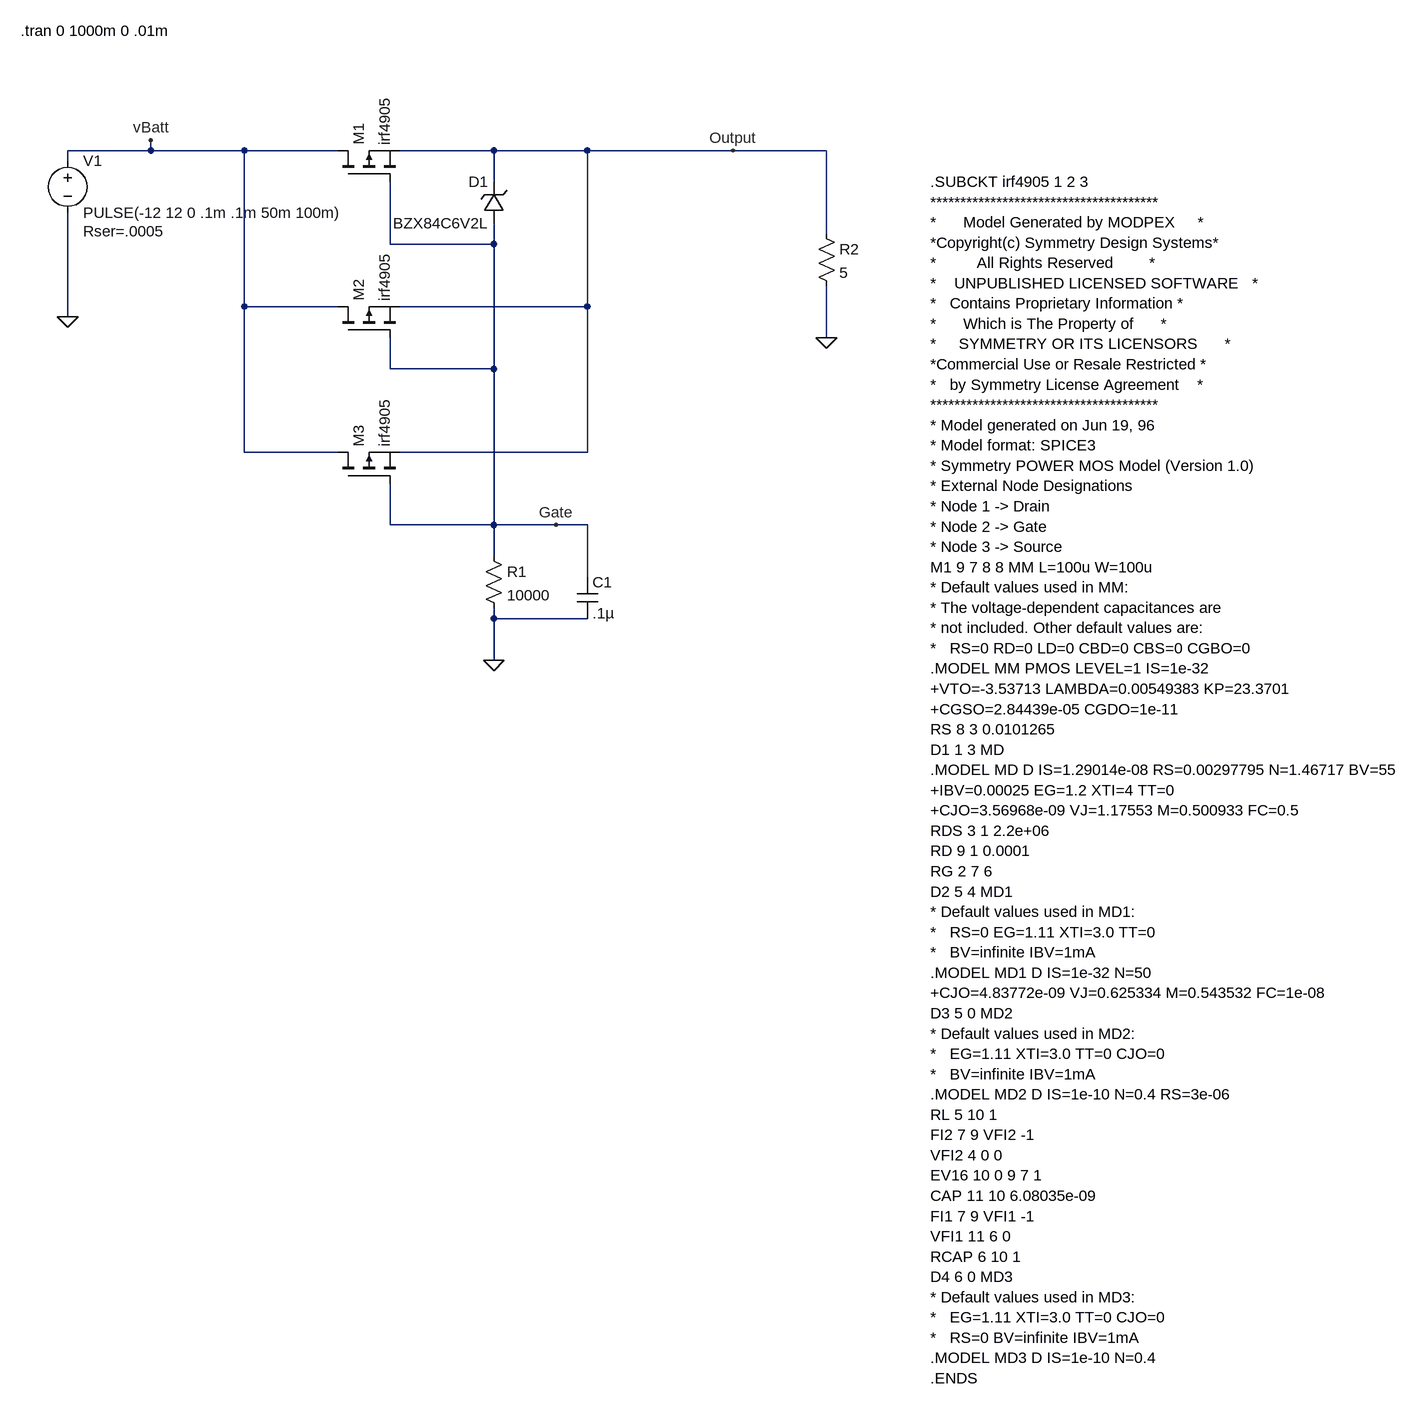
[diagram p0: schematic ReversePolarityProtection_2.asc]
ReversePolarityProtection_2.asc, the LTspice schematic file:
Version 4
SHEET 1 1748 1684
WIRE -176 -32 -176 -48
WIRE -176 -32 -304 -32
WIRE -32 -32 -176 -32
WIRE 112 -32 -32 -32
WIRE 352 -32 208 -32
WIRE 496 -32 352 -32
WIRE 720 -32 496 -32
WIRE 864 -32 720 -32
WIRE -304 -16 -304 -32
WIRE 352 16 352 -32
WIRE 864 96 864 -32
WIRE 192 112 192 16
WIRE 352 112 352 80
WIRE 352 112 192 112
WIRE -32 208 -32 -32
WIRE 112 208 -32 208
WIRE 496 208 496 -32
WIRE 496 208 208 208
WIRE -304 224 -304 64
WIRE 864 256 864 176
WIRE 192 304 192 256
WIRE 352 304 352 112
WIRE 352 304 192 304
WIRE -32 432 -32 208
WIRE 112 432 -32 432
WIRE 496 432 496 208
WIRE 496 432 208 432
WIRE 192 544 192 480
WIRE 352 544 352 304
WIRE 352 544 192 544
WIRE 448 544 352 544
WIRE 496 544 448 544
WIRE 352 592 352 544
WIRE 496 624 496 544
WIRE 352 688 352 672
WIRE 496 688 352 688
WIRE 352 752 352 688
FLAG 352 752 0
FLAG -304 224 0
FLAG 864 256 0
FLAG -176 -48 vBatt
FLAG 720 -32 Output
FLAG 448 544 Gate
SYMBOL pmos 112 16 R270
SYMATTR InstName M1
SYMATTR Value irf4905
SYMATTR Prefix X
SYMBOL pmos 112 256 R270
SYMATTR InstName M2
SYMATTR Value irf4905
SYMATTR Prefix X
SYMBOL pmos 112 480 R270
SYMATTR InstName M3
SYMATTR Value irf4905
SYMATTR Prefix X
SYMBOL voltage -304 -32 R0
WINDOW 123 0 0 Left 2
WINDOW 39 24 124 Left 2
SYMATTR SpiceLine Rser=.0005
SYMATTR InstName V1
SYMATTR Value PULSE(-12 12 0 .1m .1m 50m 100m)
SYMBOL zener 368 80 R180
WINDOW 0 24 64 Left 2
WINDOW 3 24 0 Left 2
SYMATTR InstName D1
SYMATTR Value BZX84C6V2L
SYMBOL res 336 576 R0
SYMATTR InstName R1
SYMATTR Value 10000
SYMATTR SpiceLine tol=5 pwr=.1
SYMBOL res 848 80 R0
SYMATTR InstName R2
SYMATTR Value 5
SYMATTR SpiceLine tol=5 pwr=200
SYMBOL cap 480 624 R0
SYMATTR InstName C1
SYMATTR Value .1µ
SYMATTR SpiceLine V=50
TEXT -376 -216 Left 2 !.tran 0 1000m 0 .01m
TEXT 1024 16 Left 2 !.SUBCKT irf4905 1 2 3\n**************************************\n*      Model Generated by MODPEX     *\n*Copyright(c) Symmetry Design Systems*\n*         All Rights Reserved        *\n*    UNPUBLISHED LICENSED SOFTWARE   *\n*   Contains Proprietary Information *\n*      Which is The Property of      *\n*     SYMMETRY OR ITS LICENSORS      *\n*Commercial Use or Resale Restricted *\n*   by Symmetry License Agreement    *\n**************************************\n* Model generated on Jun 19, 96\n* Model format: SPICE3\n* Symmetry POWER MOS Model (Version 1.0)\n* External Node Designations\n* Node 1 -> Drain\n* Node 2 -> Gate\n* Node 3 -> Source\nM1 9 7 8 8 MM L=100u W=100u\n* Default values used in MM:\n* The voltage-dependent capacitances are\n* not included. Other default values are:\n*   RS=0 RD=0 LD=0 CBD=0 CBS=0 CGBO=0\n.MODEL MM PMOS LEVEL=1 IS=1e-32\n+VTO=-3.53713 LAMBDA=0.00549383 KP=23.3701\n+CGSO=2.84439e-05 CGDO=1e-11\nRS 8 3 0.0101265\nD1 1 3 MD\n.MODEL MD D IS=1.29014e-08 RS=0.00297795 N=1.46717 BV=55\n+IBV=0.00025 EG=1.2 XTI=4 TT=0\n+CJO=3.56968e-09 VJ=1.17553 M=0.500933 FC=0.5\nRDS 3 1 2.2e+06\nRD 9 1 0.0001\nRG 2 7 6\nD2 5 4 MD1\n* Default values used in MD1:\n*   RS=0 EG=1.11 XTI=3.0 TT=0\n*   BV=infinite IBV=1mA\n.MODEL MD1 D IS=1e-32 N=50\n+CJO=4.83772e-09 VJ=0.625334 M=0.543532 FC=1e-08\nD3 5 0 MD2\n* Default values used in MD2:\n*   EG=1.11 XTI=3.0 TT=0 CJO=0\n*   BV=infinite IBV=1mA\n.MODEL MD2 D IS=1e-10 N=0.4 RS=3e-06\nRL 5 10 1\nFI2 7 9 VFI2 -1\nVFI2 4 0 0\nEV16 10 0 9 7 1\nCAP 11 10 6.08035e-09\nFI1 7 9 VFI1 -1\nVFI1 11 6 0\nRCAP 6 10 1\nD4 6 0 MD3\n* Default values used in MD3:\n*   EG=1.11 XTI=3.0 TT=0 CJO=0\n*   RS=0 BV=infinite IBV=1mA\n.MODEL MD3 D IS=1e-10 N=0.4\n.ENDS

The netlist it stands for:
* ReversePolarityProtection_2.asc
XM1 vBatt Gate Output irf4905  ; pins D G S
XM2 vBatt Gate Output irf4905  ; pins D G S
XM3 vBatt Gate Output irf4905  ; pins D G S
V1 vBatt 0 PULSE(-12 12 0 .1m .1m 50m 100m) Rser=.0005
D1 Gate Output BZX84C6V2L
R1 Gate 0 10000 tol=5 pwr=.1
R2 Output 0 5 tol=5 pwr=200
C1 Gate 0 .1µ V=50
.model D D
.lib standard.dio
.tran 0 1000m 0 .01m
.SUBCKT irf4905 1 2 3
**************************************
*      Model Generated by MODPEX     *
*Copyright(c) Symmetry Design Systems*
*         All Rights Reserved        *
*    UNPUBLISHED LICENSED SOFTWARE   *
*   Contains Proprietary Information *
*      Which is The Property of      *
*     SYMMETRY OR ITS LICENSORS      *
*Commercial Use or Resale Restricted *
*   by Symmetry License Agreement    *
**************************************
* Model generated on Jun 19, 96
* Model format: SPICE3
* Symmetry POWER MOS Model (Version 1.0)
* External Node Designations
* Node 1 -> Drain
* Node 2 -> Gate
* Node 3 -> Source
M1 9 7 8 8 MM L=100u W=100u
* Default values used in MM:
* The voltage-dependent capacitances are
* not included. Other default values are:
*   RS=0 RD=0 LD=0 CBD=0 CBS=0 CGBO=0
.MODEL MM PMOS LEVEL=1 IS=1e-32
+VTO=-3.53713 LAMBDA=0.00549383 KP=23.3701
+CGSO=2.84439e-05 CGDO=1e-11
RS 8 3 0.0101265
D1 1 3 MD
.MODEL MD D IS=1.29014e-08 RS=0.00297795 N=1.46717 BV=55
+IBV=0.00025 EG=1.2 XTI=4 TT=0
+CJO=3.56968e-09 VJ=1.17553 M=0.500933 FC=0.5
RDS 3 1 2.2e+06
RD 9 1 0.0001
RG 2 7 6
D2 5 4 MD1
* Default values used in MD1:
*   RS=0 EG=1.11 XTI=3.0 TT=0
*   BV=infinite IBV=1mA
.MODEL MD1 D IS=1e-32 N=50
+CJO=4.83772e-09 VJ=0.625334 M=0.543532 FC=1e-08
D3 5 0 MD2
* Default values used in MD2:
*   EG=1.11 XTI=3.0 TT=0 CJO=0
*   BV=infinite IBV=1mA
.MODEL MD2 D IS=1e-10 N=0.4 RS=3e-06
RL 5 10 1
FI2 7 9 VFI2 -1
VFI2 4 0 0
EV16 10 0 9 7 1
CAP 11 10 6.08035e-09
FI1 7 9 VFI1 -1
VFI1 11 6 0
RCAP 6 10 1
D4 6 0 MD3
* Default values used in MD3:
*   EG=1.11 XTI=3.0 TT=0 CJO=0
*   RS=0 BV=infinite IBV=1mA
.MODEL MD3 D IS=1e-10 N=0.4
.ENDS
.backanno
.end